# Altium schematic sheet [3]-MCU_MAIN.SchDoc
size A4
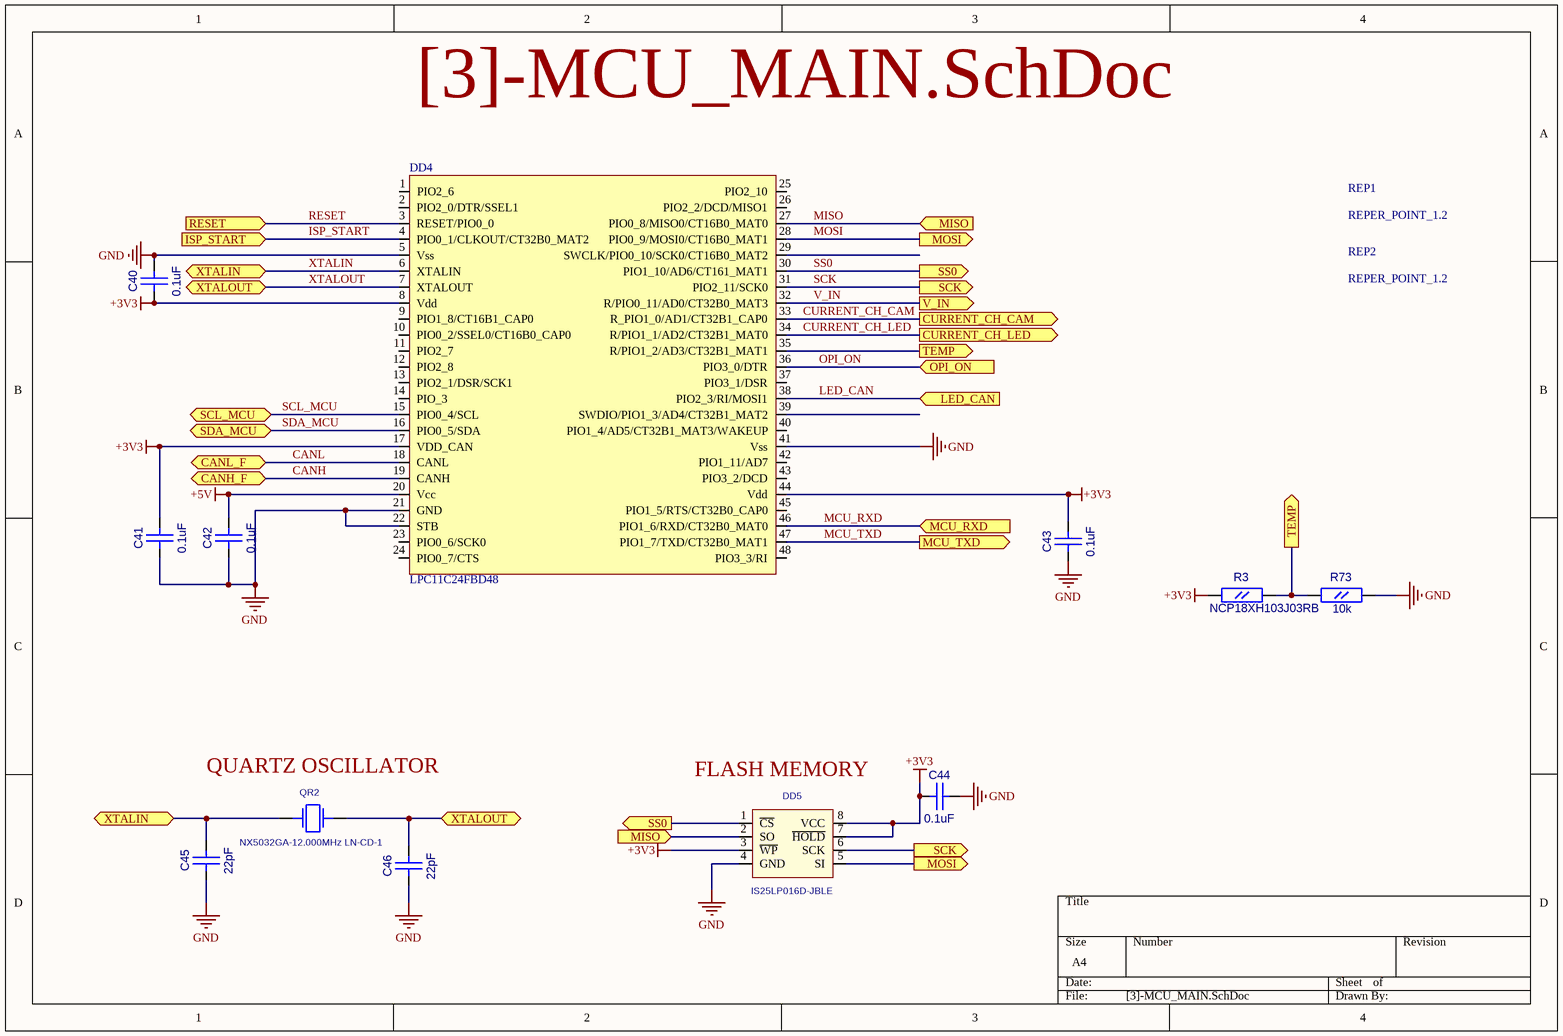
[diagram p0: [3]-MCU_MAIN.SchDoc]

## Parts
C40  0.1uF  [CC0603]
C41  0.1uF  [CC0603]
C42  0.1uF  [CC0603]
C43  0.1uF  [CC0603]
C44  0.1uF  [CC0603]
C45  22pF  [CC0603]
C46  22pF  [CC0603]
DD4  LPC11C24FBD48  [LQFP48]
DD5  IS25LP016D-JBLE  [EIAJ_SO8]
QR2  NX5032GA-12.000MHz LN-CD-1  [AC5032_2]
R3  NCP18XH103J03RB  [RC0603]
R73  10k  [RC0603]
REP1  REPER_POINT_1.2  [REPER1.2]
REP2  REPER_POINT_1.2  [REPER1.2]

## Ports
CANH_F (bidir), CANL_F (bidir), CURRENT_CH_CAM (out), CURRENT_CH_LED (out), ISP_START (in), LED_CAN (in), MCU_RXD (in), MCU_TXD (out), MISO (in), MOSI (out), OPI_ON (in), RESET (in), SCK (out), SCL_MCU (bidir), SDA_MCU (bidir), SS0 (out), TEMP (out), V_IN (out), XTALIN (bidir), XTALOUT (bidir)

## Nets
+3V3: C40.1(A) C41.2(B) C43.2(B) C44.1(A) DD4.8(Vdd) DD4.17(VDD_CAN) DD4.44(Vdd) DD5.3(~{WP}) DD5.7(~{HOLD}) DD5.8(VCC) R3.1(A)
+5V: C42.2(B) DD4.20(Vcc)
GND: C40.2(B) C41.1(A) C42.1(A) C43.1(A) C44.2(B) C45.1(A) C46.1(A) DD4.5(Vss) DD4.21(GND) DD4.22(STB) DD4.41(Vss) DD5.4(GND) R73.2(B)
CANH: DD4.19(CANH) ; port CANH_F
CANL: DD4.18(CANL) ; port CANL_F
CURRENT_CH_CAM: DD4.33(R_PIO1_0/AD1/CT32B1_CAP0) ; port CURRENT_CH_CAM
CURRENT_CH_LED: DD4.34(R/PIO1_1/AD2/CT32B1_MAT0) ; port CURRENT_CH_LED
ISP_START: DD4.4(PIO0_1/CLKOUT/CT32B0_MAT2) ; port ISP_START
LED_CAN: DD4.38(PIO2_3/RI/MOSI1) ; port LED_CAN
MCU_RXD: DD4.46(PIO1_6/RXD/CT32B0_MAT0) ; port MCU_RXD
MCU_TXD: DD4.47(PIO1_7/TXD/CT32B0_MAT1) ; port MCU_TXD
MISO: DD4.27(PIO0_8/MISO0/CT16B0_MAT0) DD5.2(SO) ; port MISO
MOSI: DD4.28(PIO0_9/MOSI0/CT16B0_MAT1) DD5.5(SI) ; port MOSI
OPI_ON: DD4.36(PIO3_0/DTR) ; port OPI_ON
RESET: DD4.3(RESET/PIO0_0) ; port RESET
SCK: DD4.31(PIO2_11/SCK0) DD5.6(SCK) ; port SCK
SCL_MCU: DD4.15(PIO0_4/SCL) ; port SCL_MCU
SDA_MCU: DD4.16(PIO0_5/SDA) ; port SDA_MCU
SS0: DD4.30(PIO1_10/AD6/CT161_MAT1) DD5.1(~{CS}) ; port SS0
TEMP: DD4.35(R/PIO1_2/AD3/CT32B1_MAT1) R3.2(B) R73.1(A) ; port TEMP
V_IN: DD4.32(R/PIO0_11/AD0/CT32B0_MAT3) ; port V_IN
XTALIN: C45.2(B) DD4.6(XTALIN) QR2.1 ; port XTALIN
XTALOUT: C46.2(B) DD4.7(XTALOUT) QR2.2 ; port XTALOUT

Not connected (* = marked no-connect by the designer): DD4 1(PIO2_6) 2(PIO2_0/DTR/SSEL1) 9(PIO1_8/CT16B1_CAP0) 10(PIO0_2/SSEL0/CT16B0_CAP0) 11(PIO2_7) 12(PIO2_8) 13(PIO2_1/DSR/SCK1) 14(PIO_3) 23(PIO0_6/SCK0) 24(PIO0_7/CTS) 25(PIO2_10) 26(PIO2_2/DCD/MISO1) 29(SWCLK/PIO0_10/SCK0/CT16B0_MAT2) 37(PIO3_1/DSR) 39(SWDIO/PIO1_3/AD4/CT32B1_MAT2) 40(PIO1_4/AD5/CT32B1_MAT3/WAKEUP) 42(PIO1_11/AD7) 43(PIO3_2/DCD) 45(PIO1_5/RTS/CT32B0_CAP0) 48(PIO3_3/RI); REP1 1; REP2 1

## Notes on the sheet
- (near QR2) QUARTZ OSCILLATOR
- (near DD5) FLASH MEMORY

## Library data of the parts
C40-C46 = CC0603
  C40-C44: Value: 0.1uF
  C45 C46: Value: 22pF
DD5 = S25FL016A0LMFI01: Value: IS25LP016D-JBLE
QR2 = AC5032_2: AC5032/2; Value: NX5032GA-12.000MHz LN-CD-1
R3 R73 = RC0603
  R3: Value: NCP18XH103J03RB
  R73: Value: 10k
REP1 REP2 = REPER1.2: Value: REPER_POINT_1.2
DD4 = LPC11C24FBD48: Value: LPC11C24FBD48